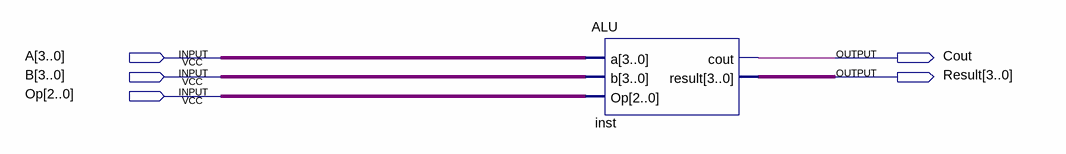
[diagram p0: schematic sheet]
// Quartus schematic Block1.bdf as structural Verilog: 1 symbols, 5 pins
module Block1 (
  input  [3:0] A,
  input  [3:0] B,
  input  [2:0] Op,
  output Cout,
  output [3:0] Result
);

  ALU inst (.a(A), .b(B), .Op(Op), .cout(Cout), .result(Result));
endmodule
